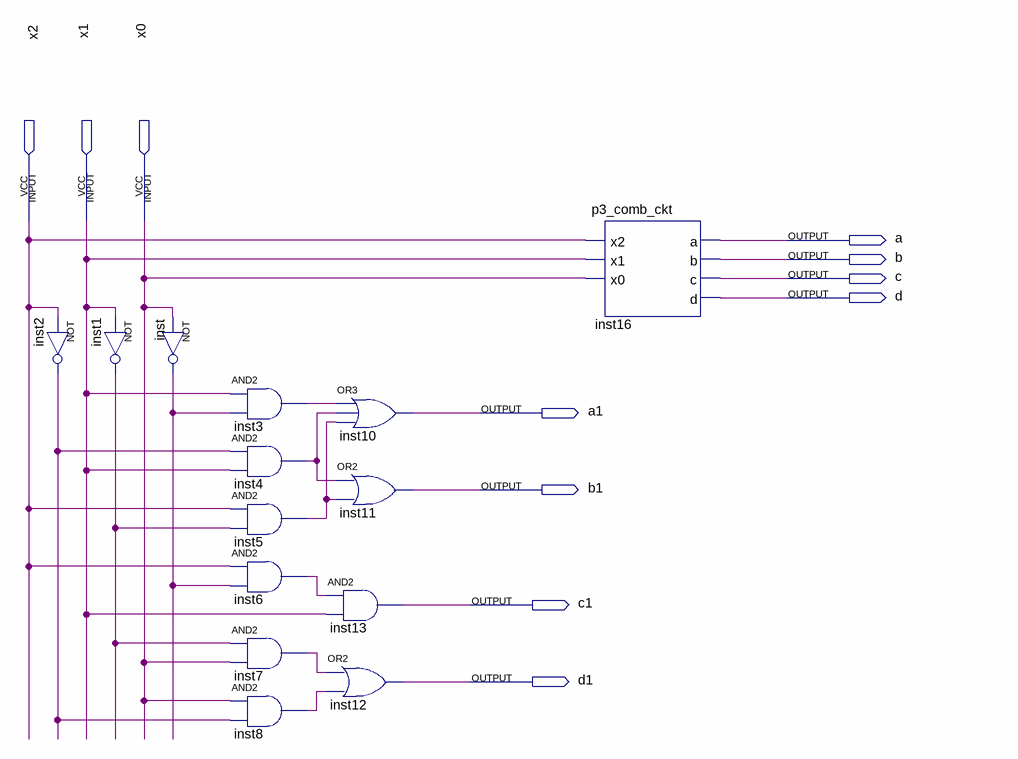
[diagram p0: schematic sheet]
// Quartus schematic hw9p3.bdf as structural Verilog: 14 symbols, 11 pins
module hw9p3 (
  input  x2,
  input  x1,
  input  x0,
  output a,
  output b,
  output c,
  output d,
  output a1,
  output b1,
  output c1,
  output d1
);

  wire inst1_out, inst2_out, inst3_out, inst4_out, inst5_out, inst6_out, inst7_out, inst8_out, inst_out;

  not inst2 (inst2_out, x2);
  not inst1 (inst1_out, x1);
  not inst (inst_out, x0);
  and inst3 (inst3_out, x1, inst_out);
  and inst4 (inst4_out, inst2_out, x1);
  and inst5 (inst5_out, x2, inst1_out);
  and inst6 (inst6_out, x2, inst_out);
  and inst7 (inst7_out, inst1_out, x0);
  and inst8 (inst8_out, x0, inst2_out);
  or inst10 (a1, inst3_out, inst4_out, inst5_out);
  or inst11 (b1, inst4_out, inst5_out);
  and inst13 (c1, inst6_out, x1);
  or inst12 (d1, inst7_out, inst8_out);
  p3_comb_ckt inst16 (.x2(x2), .x1(x1), .x0(x0), .a(a), .b(b), .c(c), .d(d));
endmodule
